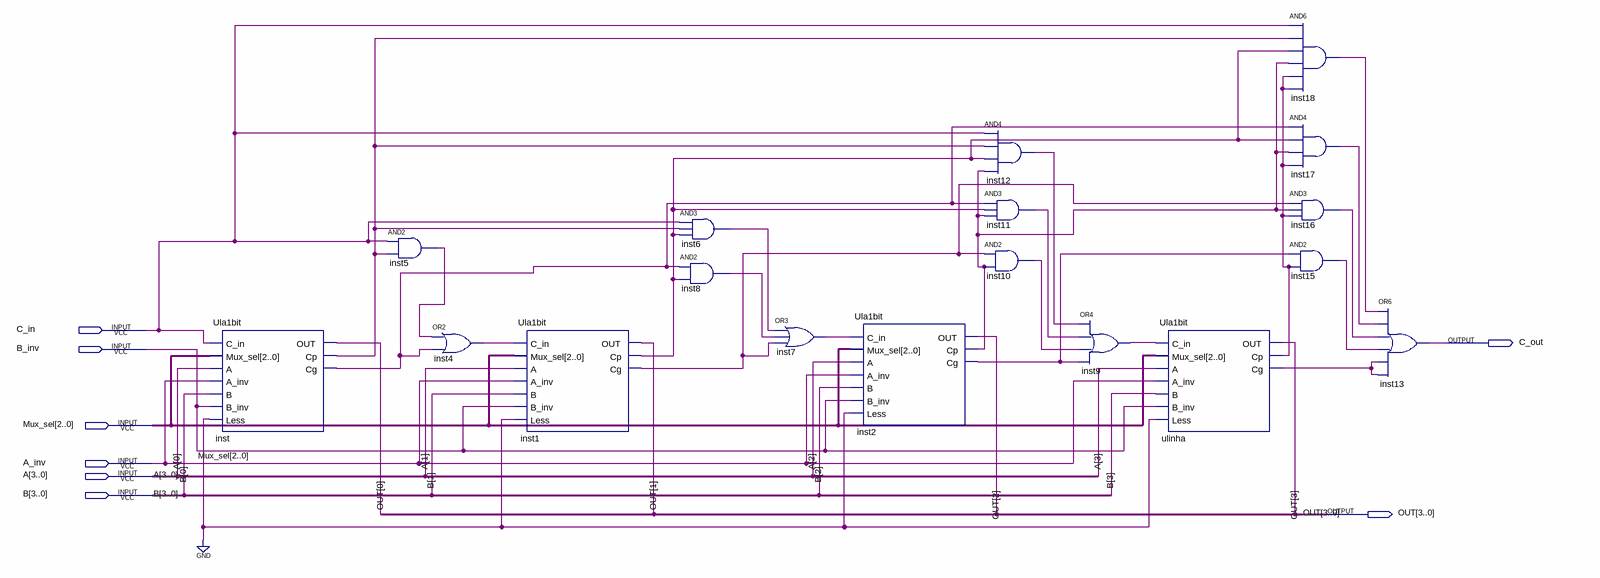
[diagram p0: schematic sheet]
// Quartus schematic Ula4bits.bdf as structural Verilog: 18 symbols, 8 pins
module Ula4bits (
  input  C_in,
  input  B_inv,
  input  [2:0] Mux_sel,
  input  A_inv,
  input  [3:0] A,
  input  [3:0] B,
  output C_out,
  output [3:0] OUT
);

  wire inst1_cg, inst1_cp, inst2_cg, inst2_cp, inst4_out, inst5_out, inst6_out, inst7_out, inst8_out,
       inst9_out, inst10_out, inst11_out, inst12_out, inst15_out, inst16_out, inst17_out, inst18_out,
       inst_cg, inst_cp, ulinha_cg, ulinha_cp;

  Ula1bit inst (
    .C_in(C_in), .Mux_sel(Mux_sel), .A(A[0]), .A_inv(A_inv), .B(B[0]), .B_inv(B_inv), .Less(1'b0),
    .OUT(OUT[0]), .Cp(inst_cp), .Cg(inst_cg));
  and inst5 (inst5_out, C_in, inst_cp);
  or inst4 (inst4_out, inst5_out, inst_cg);
  Ula1bit inst1 (
    .C_in(inst4_out), .Mux_sel(Mux_sel), .A(A[1]), .A_inv(A_inv), .B(B[1]), .B_inv(B_inv), .Less(1'b0),
    .OUT(OUT[1]), .Cp(inst1_cp), .Cg(inst1_cg));
  and inst6 (inst6_out, C_in, inst_cp, inst1_cp);
  and inst8 (inst8_out, inst_cg, inst1_cp);
  or inst7 (inst7_out, inst6_out, inst8_out, inst1_cg);
  Ula1bit inst2 (
    .C_in(inst7_out), .Mux_sel(Mux_sel), .A(A[2]), .A_inv(A_inv), .B(B[2]), .B_inv(B_inv), .Less(1'b0),
    .OUT(OUT[2]), .Cp(inst2_cp), .Cg(inst2_cg));
  and inst12 (inst12_out, C_in, inst_cp, inst1_cp, inst2_cp);
  and inst11 (inst11_out, inst_cg, inst1_cp, inst2_cp);
  and inst10 (inst10_out, inst1_cg, inst2_cp);
  or inst9 (inst9_out, inst12_out, inst11_out, inst10_out, inst2_cg);
  Ula1bit ulinha (
    .C_in(inst9_out), .Mux_sel(Mux_sel), .A(A[3]), .A_inv(A_inv), .B(B[3]), .B_inv(B_inv), .Less(1'b0),
    .OUT(OUT[3]), .Cp(ulinha_cp), .Cg(ulinha_cg));
  and inst18 (inst18_out, C_in, inst_cp, inst1_cp, inst2_cp, ulinha_cp, ulinha_cp);
  and inst17 (inst17_out, inst_cg, inst1_cp, inst2_cp, ulinha_cp);
  and inst16 (inst16_out, inst1_cg, inst2_cp, ulinha_cp);
  and inst15 (inst15_out, inst2_cg, ulinha_cp);
  or inst13 (C_out, inst18_out, inst17_out, inst16_out, inst15_out, ulinha_cg, ulinha_cg);
endmodule
